# EAGLE design BBB_ADS1271_front_panel (EAGLE 7.5.0)
ADS1271 Input board This board creates 8 BNC inputs with TVS protection for use with 4 ADS1271EVM boards.
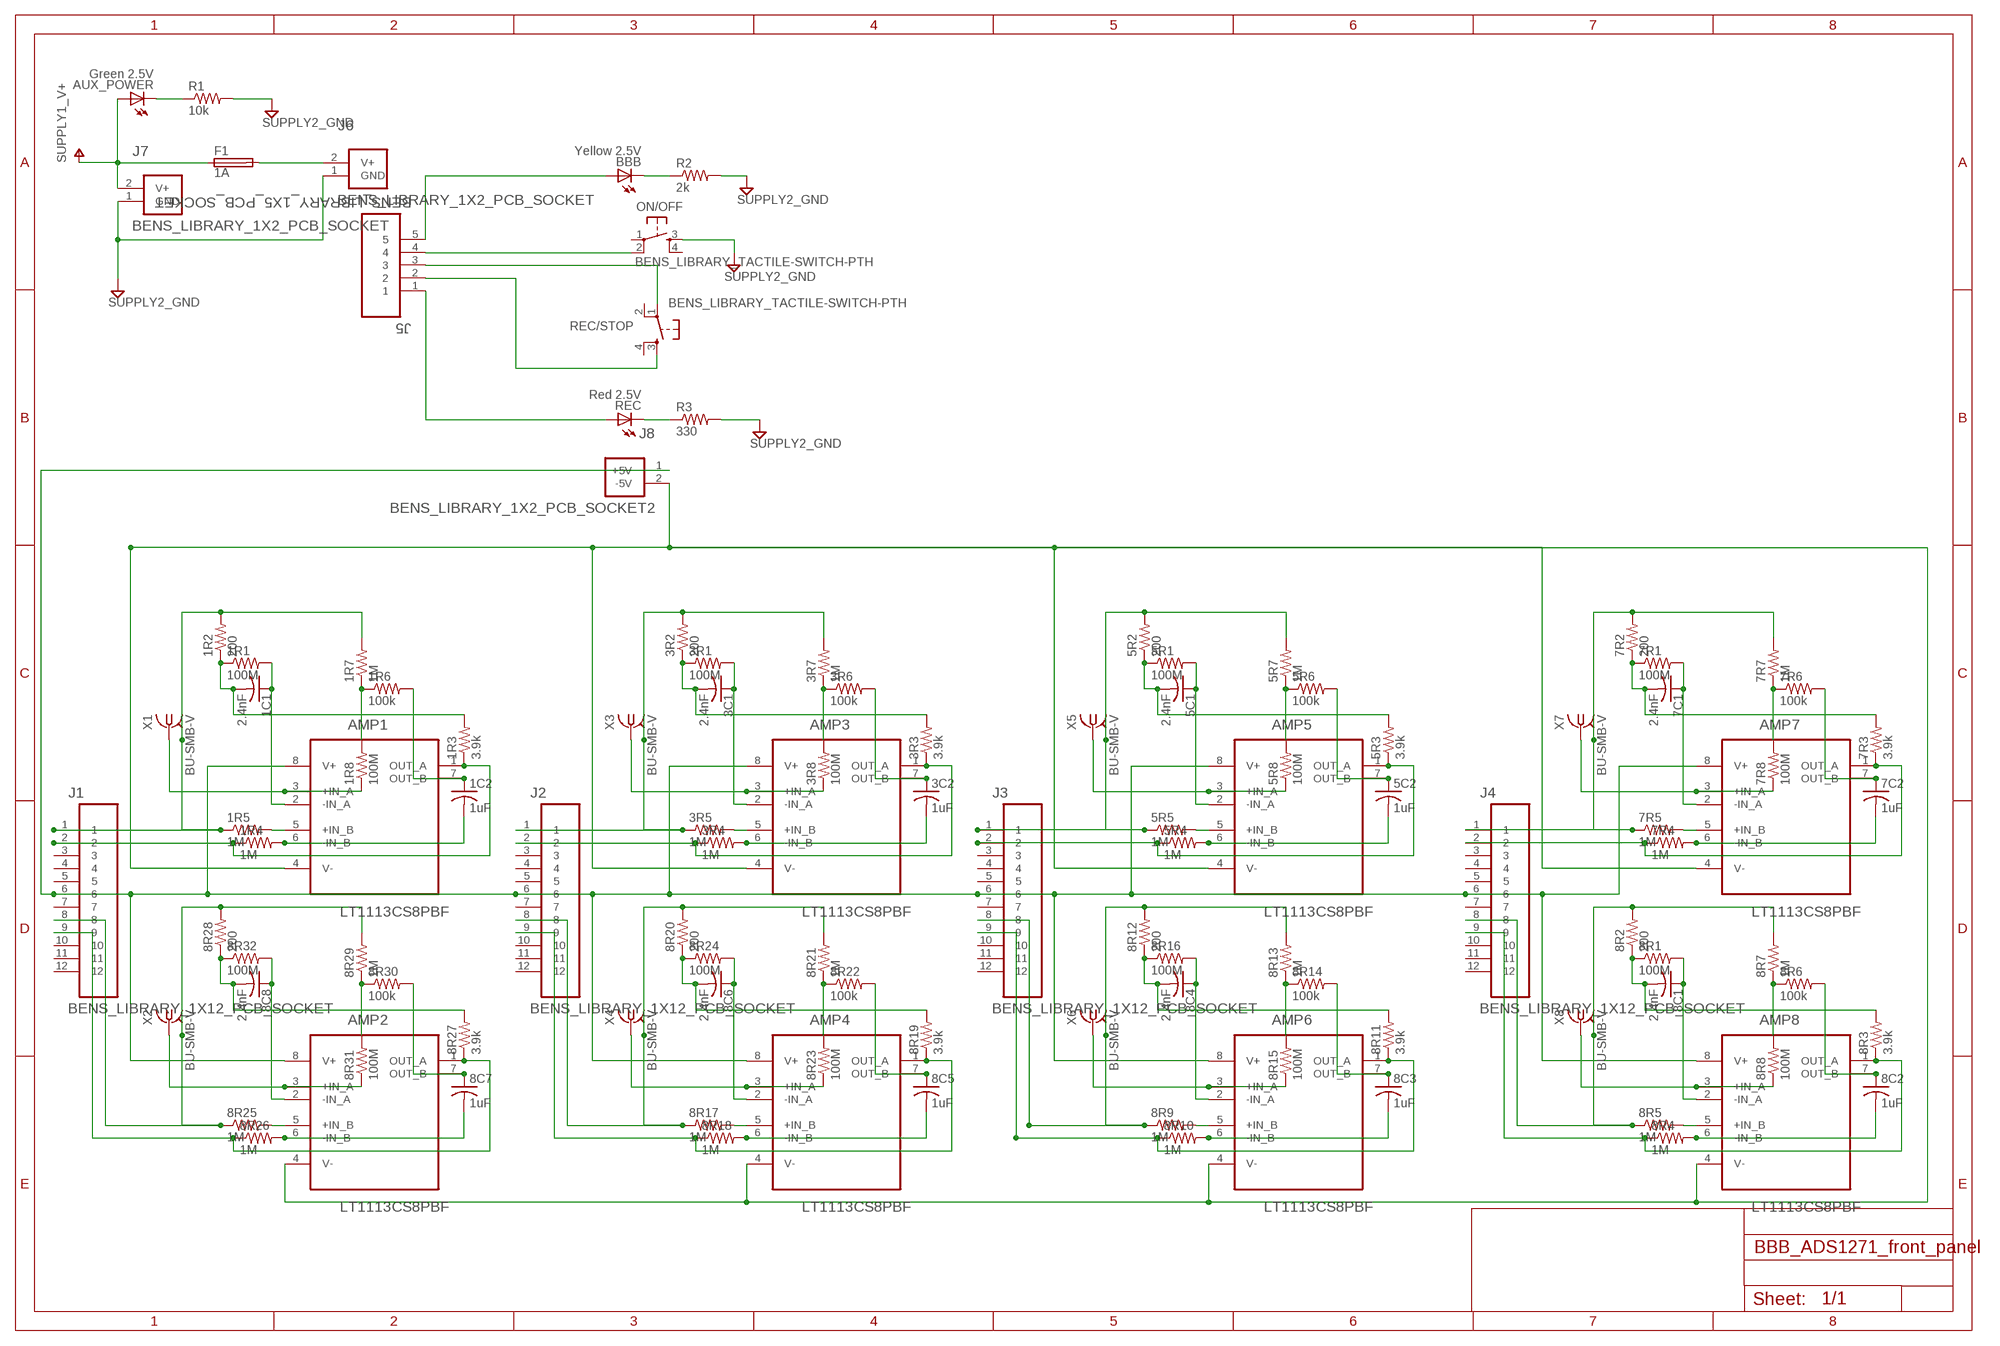
[diagram p0: schematic, sheet 1]

## Parts
1C1  2.4nF  ADAFRUIT_C-USC0805K  [ADAFRUIT_C0805K]
1C2  1uF  ADAFRUIT_C-USC0805K  [ADAFRUIT_C0805K]
1R1  100M  ADAFRUIT_R-US_R0805  [ADAFRUIT_R0805]
1R2  200  ADAFRUIT_R-US_R0805  [ADAFRUIT_R0805]
1R3  3.9k  ADAFRUIT_R-US_R0805  [ADAFRUIT_R0805]
1R4  1M  ADAFRUIT_R-US_R0805  [ADAFRUIT_R0805]
1R5  1M  ADAFRUIT_R-US_R0805  [ADAFRUIT_R0805]
1R6  100k  ADAFRUIT_R-US_R0805  [ADAFRUIT_R0805]
1R7  1M  ADAFRUIT_R-US_R0805  [ADAFRUIT_R0805]
1R8  100M  ADAFRUIT_R-US_R0805  [ADAFRUIT_R0805]
3C1  2.4nF  ADAFRUIT_C-USC0805K  [ADAFRUIT_C0805K]
3C2  1uF  ADAFRUIT_C-USC0805K  [ADAFRUIT_C0805K]
3R1  100M  ADAFRUIT_R-US_R0805  [ADAFRUIT_R0805]
3R2  200  ADAFRUIT_R-US_R0805  [ADAFRUIT_R0805]
3R3  3.9k  ADAFRUIT_R-US_R0805  [ADAFRUIT_R0805]
3R4  1M  ADAFRUIT_R-US_R0805  [ADAFRUIT_R0805]
3R5  1M  ADAFRUIT_R-US_R0805  [ADAFRUIT_R0805]
3R6  100k  ADAFRUIT_R-US_R0805  [ADAFRUIT_R0805]
3R7  1M  ADAFRUIT_R-US_R0805  [ADAFRUIT_R0805]
3R8  100M  ADAFRUIT_R-US_R0805  [ADAFRUIT_R0805]
5C1  2.4nF  ADAFRUIT_C-USC0805K  [ADAFRUIT_C0805K]
5C2  1uF  ADAFRUIT_C-USC0805K  [ADAFRUIT_C0805K]
5R1  100M  ADAFRUIT_R-US_R0805  [ADAFRUIT_R0805]
5R2  200  ADAFRUIT_R-US_R0805  [ADAFRUIT_R0805]
5R3  3.9k  ADAFRUIT_R-US_R0805  [ADAFRUIT_R0805]
5R4  1M  ADAFRUIT_R-US_R0805  [ADAFRUIT_R0805]
5R5  1M  ADAFRUIT_R-US_R0805  [ADAFRUIT_R0805]
5R6  100k  ADAFRUIT_R-US_R0805  [ADAFRUIT_R0805]
5R7  1M  ADAFRUIT_R-US_R0805  [ADAFRUIT_R0805]
5R8  100M  ADAFRUIT_R-US_R0805  [ADAFRUIT_R0805]
7C1  2.4nF  ADAFRUIT_C-USC0805K  [ADAFRUIT_C0805K]
7C2  1uF  ADAFRUIT_C-USC0805K  [ADAFRUIT_C0805K]
7R1  100M  ADAFRUIT_R-US_R0805  [ADAFRUIT_R0805]
7R2  200  ADAFRUIT_R-US_R0805  [ADAFRUIT_R0805]
7R3  3.9k  ADAFRUIT_R-US_R0805  [ADAFRUIT_R0805]
7R4  1M  ADAFRUIT_R-US_R0805  [ADAFRUIT_R0805]
7R5  1M  ADAFRUIT_R-US_R0805  [ADAFRUIT_R0805]
7R6  100k  ADAFRUIT_R-US_R0805  [ADAFRUIT_R0805]
7R7  1M  ADAFRUIT_R-US_R0805  [ADAFRUIT_R0805]
7R8  100M  ADAFRUIT_R-US_R0805  [ADAFRUIT_R0805]
8C1  2.4nF  ADAFRUIT_C-USC0805K  [ADAFRUIT_C0805K]
8C2  1uF  ADAFRUIT_C-USC0805K  [ADAFRUIT_C0805K]
8C3  1uF  ADAFRUIT_C-USC0805K  [ADAFRUIT_C0805K]
8C4  2.4nF  ADAFRUIT_C-USC0805K  [ADAFRUIT_C0805K]
8C5  1uF  ADAFRUIT_C-USC0805K  [ADAFRUIT_C0805K]
8C6  2.4nF  ADAFRUIT_C-USC0805K  [ADAFRUIT_C0805K]
8C7  1uF  ADAFRUIT_C-USC0805K  [ADAFRUIT_C0805K]
8C8  2.4nF  ADAFRUIT_C-USC0805K  [ADAFRUIT_C0805K]
8R1  100M  ADAFRUIT_R-US_R0805  [ADAFRUIT_R0805]
8R2  200  ADAFRUIT_R-US_R0805  [ADAFRUIT_R0805]
8R3  3.9k  ADAFRUIT_R-US_R0805  [ADAFRUIT_R0805]
8R4  1M  ADAFRUIT_R-US_R0805  [ADAFRUIT_R0805]
8R5  1M  ADAFRUIT_R-US_R0805  [ADAFRUIT_R0805]
8R6  100k  ADAFRUIT_R-US_R0805  [ADAFRUIT_R0805]
8R7  1M  ADAFRUIT_R-US_R0805  [ADAFRUIT_R0805]
8R8  100M  ADAFRUIT_R-US_R0805  [ADAFRUIT_R0805]
8R9  1M  ADAFRUIT_R-US_R0805  [ADAFRUIT_R0805]
8R10  1M  ADAFRUIT_R-US_R0805  [ADAFRUIT_R0805]
8R11  3.9k  ADAFRUIT_R-US_R0805  [ADAFRUIT_R0805]
8R12  200  ADAFRUIT_R-US_R0805  [ADAFRUIT_R0805]
8R13  1M  ADAFRUIT_R-US_R0805  [ADAFRUIT_R0805]
8R14  100k  ADAFRUIT_R-US_R0805  [ADAFRUIT_R0805]
8R15  100M  ADAFRUIT_R-US_R0805  [ADAFRUIT_R0805]
8R16  100M  ADAFRUIT_R-US_R0805  [ADAFRUIT_R0805]
8R17  1M  ADAFRUIT_R-US_R0805  [ADAFRUIT_R0805]
8R18  1M  ADAFRUIT_R-US_R0805  [ADAFRUIT_R0805]
8R19  3.9k  ADAFRUIT_R-US_R0805  [ADAFRUIT_R0805]
8R20  200  ADAFRUIT_R-US_R0805  [ADAFRUIT_R0805]
8R21  1M  ADAFRUIT_R-US_R0805  [ADAFRUIT_R0805]
8R22  100k  ADAFRUIT_R-US_R0805  [ADAFRUIT_R0805]
8R23  100M  ADAFRUIT_R-US_R0805  [ADAFRUIT_R0805]
8R24  100M  ADAFRUIT_R-US_R0805  [ADAFRUIT_R0805]
8R25  1M  ADAFRUIT_R-US_R0805  [ADAFRUIT_R0805]
8R26  1M  ADAFRUIT_R-US_R0805  [ADAFRUIT_R0805]
8R27  3.9k  ADAFRUIT_R-US_R0805  [ADAFRUIT_R0805]
8R28  200  ADAFRUIT_R-US_R0805  [ADAFRUIT_R0805]
8R29  1M  ADAFRUIT_R-US_R0805  [ADAFRUIT_R0805]
8R30  100k  ADAFRUIT_R-US_R0805  [ADAFRUIT_R0805]
8R31  100M  ADAFRUIT_R-US_R0805  [ADAFRUIT_R0805]
8R32  100M  ADAFRUIT_R-US_R0805  [ADAFRUIT_R0805]
AMP1  LT1113CS8PBF  [SOIC127P600X175-8N]
AMP2  LT1113CS8PBF  [SOIC127P600X175-8N]
AMP3  LT1113CS8PBF  [SOIC127P600X175-8N]
AMP4  LT1113CS8PBF  [SOIC127P600X175-8N]
AMP5  LT1113CS8PBF  [SOIC127P600X175-8N]
AMP6  LT1113CS8PBF  [SOIC127P600X175-8N]
AMP7  LT1113CS8PBF  [SOIC127P600X175-8N]
AMP8  LT1113CS8PBF  [SOIC127P600X175-8N]
AUX_POWER  Green 2.5V  ADAFRUIT_LED5MM  [ADAFRUIT_LED5MM]
BBB  Yellow 2.5V  ADAFRUIT_LED5MM  [ADAFRUIT_LED5MM]
F1  1A  LITTLEFUSE_SMD  [LITTLEFUSE_PACKAGE]
J1  BENS_LIBRARY_1X12_PCB_SOCKET  [BENS_LIBRARY_SAMTEC_SSM-112-L-DV-BE]
J2  BENS_LIBRARY_1X12_PCB_SOCKET  [BENS_LIBRARY_SAMTEC_SSM-112-L-DV-BE]
J3  BENS_LIBRARY_1X12_PCB_SOCKET  [BENS_LIBRARY_SAMTEC_SSM-112-L-DV-BE]
J4  BENS_LIBRARY_1X12_PCB_SOCKET  [BENS_LIBRARY_SAMTEC_SSM-112-L-DV-BE]
J5  BENS_LIBRARY_1X5_PCB_SOCKET  [BENS_LIBRARY_SAMTEC_SSM-15-L-DV-BE]
J6  BENS_LIBRARY_1X2_PCB_SOCKET  [BENS_LIBRARY_1X2_PCB_SOCKET]
J7  BENS_LIBRARY_1X2_PCB_SOCKET  [BENS_LIBRARY_1X2_PCB_SOCKET]
J8  BENS_LIBRARY_1X2_PCB_SOCKET2  [BENS_LIBRARY_1X2_PCB_SOCKET2]
ON/OFF  BENS_LIBRARY_TACTILE-SWITCH-PTH  [BENS_LIBRARY_TAC-SWITCH-PTH]
R1  10k  ADAFRUIT_R-US_R0805  [ADAFRUIT_R0805]
R2  2k  ADAFRUIT_R-US_R0805  [ADAFRUIT_R0805]
R3  330  ADAFRUIT_R-US_R0805  [ADAFRUIT_R0805]
REC  Red 2.5V  ADAFRUIT_LED5MM  [ADAFRUIT_LED5MM]
REC/STOP  BENS_LIBRARY_TACTILE-SWITCH-PTH  [BENS_LIBRARY_TAC-SWITCH-PTH]
X1  BU-SMB-V  [BU-SMB-V]
X2  BU-SMB-V  [BU-SMB-V]
X3  BU-SMB-V  [BU-SMB-V]
X4  BU-SMB-V  [BU-SMB-V]
X5  BU-SMB-V  [BU-SMB-V]
X6  BU-SMB-V  [BU-SMB-V]
X7  BU-SMB-V  [BU-SMB-V]
X8  BU-SMB-V  [BU-SMB-V]

## Nets
1+IN_B: 1R5.2 AMP1.5(+IN_B)
1-IN_A: 1C1.1 1R1.2 AMP1.2(-IN_A)
1-IN_B: 1C2.2 1R4.2 AMP1.6(-IN_B)
1OUT_B: 1C2.1 1R6.2 AMP1.7(OUT_B)
1W1: 1C1.2 1R1.1 1R2.1 1R3.2
1W2: 1R6.1 1R7.1 1R8.2
2+IN_B: 8R25.2 AMP2.5(+IN_B)
2-IN_A: 8C8.1 8R32.2 AMP2.2(-IN_A)
2-IN_B: 8C7.2 8R26.2 AMP2.6(-IN_B)
2OUT_B: 8C7.1 8R30.2 AMP2.7(OUT_B)
2W1: 8C8.2 8R27.2 8R28.1 8R32.1
2W2: 8R29.1 8R30.1 8R31.2
3+IN_B: 3R5.2 AMP3.5(+IN_B)
3-IN_A: 3C1.1 3R1.2 AMP3.2(-IN_A)
3-IN_B: 3C2.2 3R4.2 AMP3.6(-IN_B)
3OUT_B: 3C2.1 3R6.2 AMP3.7(OUT_B)
3W1: 3C1.2 3R1.1 3R2.1 3R3.2
3W2: 3R6.1 3R7.1 3R8.2
4+IN_B: 8R17.2 AMP4.5(+IN_B)
4-IN_A: 8C6.1 8R24.2 AMP4.2(-IN_A)
4-IN_B: 8C5.2 8R18.2 AMP4.6(-IN_B)
4OUT_B: 8C5.1 8R22.2 AMP4.7(OUT_B)
4W1: 8C6.2 8R19.2 8R20.1 8R24.1
4W2: 8R21.1 8R22.1 8R23.2
5+IN_B: 5R5.2 AMP5.5(+IN_B)
5-IN_A: 5C1.1 5R1.2 AMP5.2(-IN_A)
5-IN_B: 5C2.2 5R4.2 AMP5.6(-IN_B)
5OUT_B: 5C2.1 5R6.2 AMP5.7(OUT_B)
5W1: 5C1.2 5R1.1 5R2.1 5R3.2
5W2: 5R6.1 5R7.1 5R8.2
6+IN_B: 8R9.2 AMP6.5(+IN_B)
6-IN_A: 8C4.1 8R16.2 AMP6.2(-IN_A)
6-IN_B: 8C3.2 8R10.2 AMP6.6(-IN_B)
6OUT_B: 8C3.1 8R14.2 AMP6.7(OUT_B)
6W1: 8C4.2 8R11.2 8R12.1 8R16.1
6W2: 8R13.1 8R14.1 8R15.2
7+IN_B: 7R5.2 AMP7.5(+IN_B)
7-IN_A: 7C1.1 7R1.2 AMP7.2(-IN_A)
7-IN_B: 7C2.2 7R4.2 AMP7.6(-IN_B)
7OUT_B: 7C2.1 7R6.2 AMP7.7(OUT_B)
7W1: 7C1.2 7R1.1 7R2.1 7R3.2
7W2: 7R6.1 7R7.1 7R8.2
8+IN_B: 8R5.2 AMP8.5(+IN_B)
8-IN_A: 8C1.1 8R1.2 AMP8.2(-IN_A)
8-IN_B: 8C2.2 8R4.2 AMP8.6(-IN_B)
8OUT_B: 8C2.1 8R6.2 AMP8.7(OUT_B)
8W1: 8C1.2 8R1.1 8R2.1 8R3.2
8W2: 8R6.1 8R7.1 8R8.2
+5V: AMP1.8(V+) AMP2.8(V+) AMP3.8(V+) AMP4.8(V+) AMP5.8(V+) AMP6.8(V+) AMP7.8(V+) AMP8.8(V+) J1.6 J2.6 J3.6 J4.6 J8.1(+5V)
-5V: AMP1.4(V-) AMP2.4(V-) AMP3.4(V-) AMP4.4(V-) AMP5.4(V-) AMP6.4(V-) AMP7.4(V-) AMP8.4(V-) J8.2(-5V)
ADC1_NEG: 1R3.1 1R4.1 AMP1.1(OUT_A) J1.2
ADC1_POS: 1R2.2 1R5.1 1R7.2 J1.1 X1.2 X1.3 X1.4 X1.5
ADC2_NEG: 8R26.1 8R27.1 AMP2.1(OUT_A) J1.9
ADC2_POS: 8R25.1 8R28.2 8R29.2 J1.8 X2.2 X2.3 X2.4 X2.5
ADC3_NEG: 3R3.1 3R4.1 AMP3.1(OUT_A) J2.2
ADC3_POS: 3R2.2 3R5.1 3R7.2 J2.1 X3.2 X3.3 X3.4 X3.5
ADC4_NEG: 8R18.1 8R19.1 AMP4.1(OUT_A) J2.9
ADC4_POS: 8R17.1 8R20.2 8R21.2 J2.8 X4.2 X4.3 X4.4 X4.5
ADC5_NEG: 5R3.1 5R4.1 AMP5.1(OUT_A) J3.2
ADC5_POS: 5R2.2 5R5.1 5R7.2 J3.1 X5.2 X5.3 X5.4 X5.5
ADC6_NEG: 8R10.1 8R11.1 AMP6.1(OUT_A) J3.9
ADC6_POS: 8R9.1 8R12.2 8R13.2 J3.8 X6.2 X6.3 X6.4 X6.5
ADC7_NEG: 7R3.1 7R4.1 AMP7.1(OUT_A) J4.2
ADC7_POS: 7R2.2 7R5.1 7R7.2 J4.1 X7.2 X7.3 X7.4 X7.5
ADC8_NEG: 8R3.1 8R4.1 AMP8.1(OUT_A) J4.9
ADC8_POS: 8R2.2 8R5.1 8R7.2 J4.8 X8.2 X8.3 X8.4 X8.5
GND: J6.1(GND) J7.1(GND) ON/OFF.3 R1.2 R2.2 R3.2 ; supply symbol labelled SUPPLY2_GND
INPUT1_NEG: 1R8.1 AMP1.3(+IN_A) X1.1
INPUT2_NEG: 8R31.1 AMP2.3(+IN_A) X2.1
INPUT3_NEG: 3R8.1 AMP3.3(+IN_A) X3.1
INPUT4_NEG: 8R23.1 AMP4.3(+IN_A) X4.1
INPUT5_NEG: 5R8.1 AMP5.3(+IN_A) X5.1
INPUT6_NEG: 8R15.1 AMP6.3(+IN_A) X6.1
INPUT7_NEG: 7R8.1 AMP7.3(+IN_A) X7.1
INPUT8_NEG: 8R8.1 AMP8.3(+IN_A) X8.1
N$10: BBB.A J5.5
N$11: AUX_POWER.K(C) R1.1
N$12: J5.1 REC.A
N$13: J5.4 ON/OFF.2
N$15: J5.3 REC/STOP.1
N$16: J5.2 REC/STOP.3
N$18: R3.1 REC.K(C)
N$20: BBB.K(C) R2.1
V+: AUX_POWER.A F1.P$1 J7.2(V+) ; supply symbol labelled SUPPLY1_V+
V+_FUSED: F1.P$2 J6.2(V+)
Unconnected: J1.3 J1.4 J1.5 J1.7 J1.10 J1.11 J1.12 J2.3 J2.4 J2.5 J2.7 J2.10 J2.11 J2.12 J3.3 J3.4 J3.5 J3.7 J3.10 J3.11 J3.12 J4.3 J4.4 J4.5 J4.7 J4.10 J4.11 J4.12 ON/OFF.1 ON/OFF.4 REC/STOP.2 REC/STOP.4

## Library data of the parts
1C1 1C2 3C1 3C2 5C1 5C2 7C1 7C2 8C1-8C8 = BBB_ADS1271_front_panel:ADAFRUIT_C-US: CAPACITOR, American symbol
1R1-1R8 3R1-3R8 5R1-5R8 7R1-7R8 8R1-8R32 R1-R3 = BBB_ADS1271_front_panel:ADAFRUIT_R-US_: RESISTOR, American symbol
AMP1-AMP8 = BBB_ADS1271_front_panel:LT1113CS8PBF: Dual Low Noise,Precision, JFET Input Op Amp; MPN: LT1113CS8#PBF; OC_FARNELL: 1503417; OC_NEWARK: 57M1747; PACKAGE: SOIC-8; SUPPLIER: Linear Technology
AUX_POWER BBB REC = BBB_ADS1271_front_panel:ADAFRUIT_LED: LED OSRAM: - CHIPLED LG R971, LG N971, LY N971, LG Q971, LY Q971, LO R971, LY R971 LH N974, LH R974 LS Q976, LO Q976, LY Q976 LO Q996 - Hyper CHIPLED LW Q18S LB Q993, LB Q99A, LB R99A - SideLED LS A670, LO A670, LY A670, LG A670, LP A670 LB A673, LV A673, LT A673, LW A673 LH A674 LY A675 LS A676, LA A676, LO A676, LY A676, LW A676 LS A679, LY A679, LG A679 - Hyper Micro SIDELED® LS Y876, LA Y876, LO Y876, LY Y876 LT Y87S - SmartLED LW L88C, LW L88S LB L89C, LB L89S, LG L890 LS L89K, LO L89K, LY L89K LS L896, LA L896, LO L896, LY L896 - TOPLED LS T670, LO T670, LY T670, LG T670, LP T670 LSG T670, LSP T670, LSY T670, LOP T670, LYG T670 LG T671, LOG T671, LSG T671 LB T673, LV T673, LT T673, LW T673 LH T674 LS T676, LA T676, LO T676, LY T676, LB T676, LH T676, LSB T676, LW T676 LB T67C, LV T67C, LT T67C, LS T67K, LO T67K, LY T67K, LW E67C LS E67B, LA E67B, LO E67B, LY E67B, LB E67C, LV E67C, LT E67C LW T67C LS T679, LY T679, LG T679 LS T770, LO T770, LY T770, LG T770, LP T770 LB T773, LV T773, LT T773, LW T773 LH T774 LS E675, LA E675, LY E675, LS T675 LS T776, LA T776, LO T776, LY T776, LB T776 LHGB T686 LT T68C, LB T68C - Hyper Mini TOPLED® LB M676 - Mini TOPLED Santana® LG M470 LS M47K, LO M47K, LY M47K Source: http://www.osram.convergy.de/
F1 = BBB_ADS1271_front_panel:LITTLEFUSE_SMD: FUSE HOLDER LittleFuse surface mounted fuse
J1-J4 = BBB_ADS1271_front_panel:BENS_LIBRARY_1X12_PCB_SOCKET: CONN SOCKET, 2.54MM, SMT, 1X12WAY; MPN: SSM-112-L-DV-BE; OC_FARNELL: -; OC_NEWARK: 81P5226; PACKAGE: SOCKET, 2.54MM, SMT, 2X12WAY; SUPPLIER: SAMTEC
J5 = BBB_ADS1271_front_panel:BENS_LIBRARY_1X5_PCB_SOCKET: CONN SOCKET, 2.54MM, SMT, 1X5WAY
J6 J7 = BBB_ADS1271_front_panel:BENS_LIBRARY_1X2_PCB_SOCKET: CONN SOCKET, 2.54MM, SMT, 1X5WAY
J8 = BBB_ADS1271_front_panel:BENS_LIBRARY_1X2_PCB_SOCKET2: CONN SOCKET, 2.54MM, SMT, 1X5WAY
ON/OFF REC/STOP = BBB_ADS1271_front_panel:BENS_LIBRARY_TACTILE-SWITCH: Tactile Switch 4 Pins, SPST NO
X1-X8 = BBB_ADS1271_front_panel:BU-SMB-V: FEMALE SMB CONNECTOR Radiall distributor RS 112-2993; OC_FARNELL: unknown; OC_NEWARK: unknown

## Board
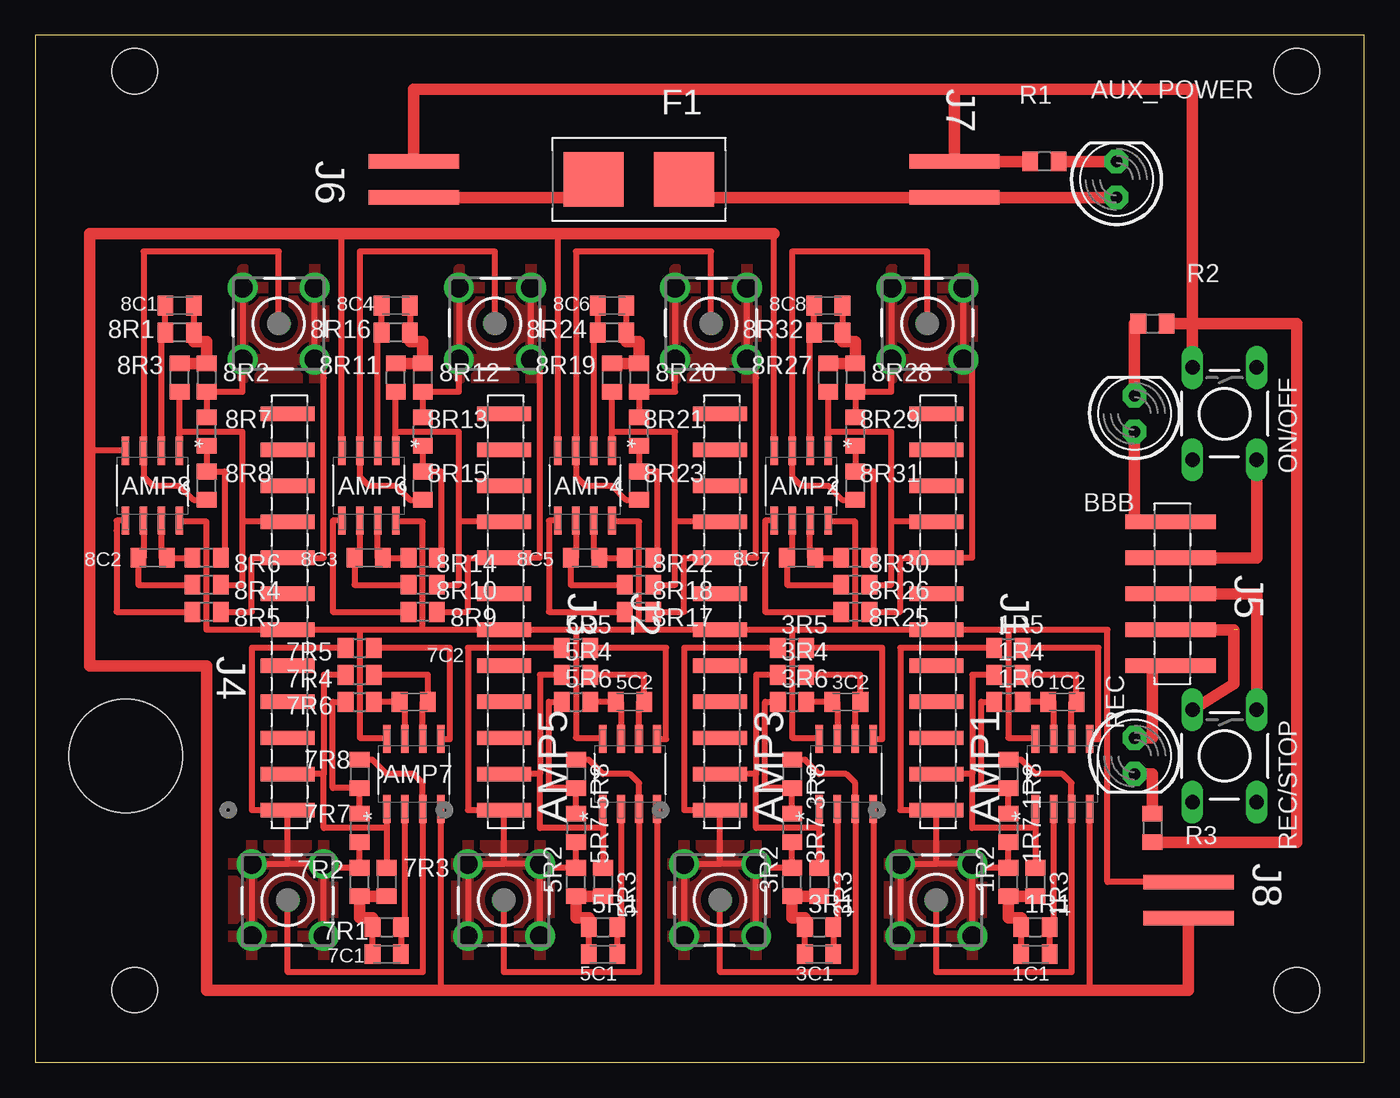
[diagram p1: board, top side]

Size 93.65 x 72.38 mm. Coordinates in mm from the lower left corner, seen from the top.
Outline: 0,0 93.65,0 93.65,72.38 0,72.38 0,0
Copper layers (1*16): Top 0.035mm / dielectric 1.5mm / Bottom 0.035mm
Design rules "default *": minimum track width 10mil, minimum drill 24mil, track to track 20mil, track to pad 20mil, pad to pad 20mil, via to via 20mil, smd to smd 8mil, copper to edge 40mil, drill to drill 8mil, minimum pad ring 10mil, minimum via ring 8mil, stop-mask expansion 4mil, vias tented up to drill 0mil, thermal gap 10mil
Holes 3.2 mm at 6.99,69.85 88.9,69.85 88.9,5.08 6.99,5.08
Holes 8 mm at 6.35,21.59
tKeepout: area 0,0 to 94,72.4

### Footprints (pad centres in the part's own frame; a part is rotated, then mirrored left to right if it is on the bottom)
ADAFRUIT_C0805K = smd 1.1 x 1.4: 1 -1,0; 2 1,0
ADAFRUIT_R0805 = smd 1.1 x 1.4: 1 -1,0; 2 1,0
SOIC127P600X175-8N = smd 1.981 x 0.533: 1 -2.464,1.905; 2 -2.464,0.635; 3 -2.464,-0.635; 4 -2.464,-1.905; 5 2.464,-1.905; 6 2.464,-0.635; 7 2.464,0.635; 8 2.464,1.905
ADAFRUIT_LED5MM = drill 0.813 pad 1.676 octagon: A -1.27,0; K 1.27,0
LITTLEFUSE_PACKAGE = smd 4.242 x 3.81: P$1 0,0; P$2 6.375,0
BENS_LIBRARY_SAMTEC_SSM-112-L-DV-BE = smd 1.016 x 3.81: 1 27.94,0; 2 25.4,0; 3 22.86,0; 4 20.32,0; 5 17.78,0; 6 15.24,0; 7 12.7,0; 8 10.16,0; 9 7.62,0; 10 5.08,0; 11 2.54,0; 12 0,0
BENS_LIBRARY_SAMTEC_SSM-15-L-DV-BE = smd 1.016 x 6.35: 1 12.7,0; 2 10.16,0; 3 7.62,0; 4 5.08,0; 5 2.54,0
BENS_LIBRARY_1X2_PCB_SOCKET = smd 1.016 x 6.35: 1 2.54,0; 2 5.08,0
BENS_LIBRARY_1X2_PCB_SOCKET2 = smd 1.016 x 6.35: 1 2.54,0; 2 5.08,0
BENS_LIBRARY_TAC-SWITCH-PTH = drill 1.016 pad 1.524 long: 1 -3.251,2.261; 2 3.251,2.261; 3 -3.251,-2.261; 4 3.251,-2.261
BU-SMB-V = drill 1.1: 1 0,0 | drill 1.4: 2 -2.54,2.54; 3 2.54,2.54; 4 2.54,-2.54; 5 -2.54,-2.54

### Placement (x,y rotation side)
1C1  70.48,7.62 180 top
1C2  72.39,25.4 0 top
1R1  70.48,9.53 0 top
1R2  68.58,12.7 90 top
1R3  70.48,12.7 270 top
1R4  68.58,27.3 0 top
1R5  68.58,29.21 0 top
1R6  68.58,25.4 0 top
1R7  68.58,16.51 270 top
1R8  68.58,20.32 270 top
3C1  55.24,7.62 180 top
3C2  57.15,25.4 0 top
3R1  55.24,9.53 0 top
3R2  53.34,12.7 90 top
3R3  55.24,12.7 270 top
3R4  53.34,27.3 0 top
3R5  53.34,29.21 0 top
3R6  53.34,25.4 0 top
3R7  53.34,16.51 270 top
3R8  53.34,20.32 270 top
5C1  40.01,7.62 180 top
5C2  41.91,25.4 0 top
5R1  40.01,9.53 0 top
5R2  38.1,12.7 90 top
5R3  40.01,12.7 270 top
5R4  38.1,27.3 0 top
5R5  38.1,29.21 0 top
5R6  38.1,25.4 0 top
5R7  38.1,16.51 270 top
5R8  38.1,20.32 270 top
7C1  24.77,7.62 180 top
7C2  26.67,25.4 0 top
7R1  24.77,9.53 0 top
7R2  22.86,12.7 90 top
7R3  24.77,12.7 270 top
7R4  22.86,27.3 0 top
7R5  22.86,29.21 0 top
7R6  22.86,25.4 0 top
7R7  22.86,16.51 270 top
7R8  22.86,20.32 270 top
8C1  10.16,53.34 0 top
8C2  8.26,35.56 180 top
8C3  23.5,35.56 180 top
8C4  25.4,53.34 0 top
8C5  38.73,35.56 180 top
8C6  40.64,53.34 0 top
8C7  53.98,35.56 180 top
8C8  55.88,53.34 0 top
8R1  10.16,51.44 180 top
8R2  12.06,48.26 270 top
8R3  10.16,48.26 90 top
8R4  12.06,33.66 180 top
8R5  12.06,31.75 180 top
8R6  12.06,35.56 180 top
8R7  12.06,44.45 90 top
8R8  12.06,40.64 90 top
8R9  27.3,31.75 180 top
8R10  27.3,33.66 180 top
8R11  25.4,48.26 90 top
8R12  27.3,48.26 270 top
8R13  27.3,44.45 90 top
8R14  27.3,35.56 180 top
8R15  27.3,40.64 90 top
8R16  25.4,51.44 180 top
8R17  42.55,31.75 180 top
8R18  42.55,33.66 180 top
8R19  40.64,48.26 90 top
8R20  42.55,48.26 270 top
8R21  42.55,44.45 90 top
8R22  42.55,35.56 180 top
8R23  42.55,40.64 90 top
8R24  40.64,51.44 180 top
8R25  57.78,31.75 180 top
8R26  57.78,33.66 180 top
8R27  55.88,48.26 90 top
8R28  57.78,48.26 270 top
8R29  57.78,44.45 90 top
8R30  57.78,35.56 180 top
8R31  57.78,40.64 90 top
8R32  55.88,51.44 180 top
AMP1  72.39,20.32 90 top
AMP2  53.98,40.64 270 top
AMP3  57.15,20.32 90 top
AMP4  38.73,40.64 270 top
AMP5  41.91,20.32 90 top
AMP6  23.5,40.64 270 top
AMP7  26.67,20.32 90 top
AMP8  8.26,40.64 270 top
AUX_POWER  76.2,62.23 90 top
BBB  77.47,45.72 90 top
F1  45.72,62.23 180 top
J1  63.5,45.72 270 top
J2  48.26,45.72 270 top
J3  33.02,45.72 270 top
J4  17.78,45.72 270 top
J5  80.01,40.64 270 top
J6  26.67,66.04 270 top
J7  64.77,66.04 270 top
J8  81.28,15.24 270 top
ON/OFF  83.82,45.72 270 top
R1  71.12,63.5 180 top
R2  78.74,52.07 0 top
R3  78.74,16.51 270 top
REC  77.47,21.59 270 top
REC/STOP  83.82,21.59 270 top
X1  63.5,11.43 180 top
X2  62.87,52.07 0 top
X3  48.26,11.43 180 top
X4  47.62,52.07 0 top
X5  33.02,11.43 180 top
X6  32.38,52.07 0 top
X7  17.78,11.43 180 top
X8  17.14,52.07 0 top

### Tracks (layer width: path | path; a pad name or v marks a point on that pad's centre or on a via)
1+IN_B
  Top 0.406: AMP1.5 74.93,22.78 74.93,29.21 1R5.2
1-IN_A
  Top 0.406: 1C1.1 1R1.2 71.75,10.16 AMP1.2
1-IN_B
  Top 0.406: AMP1.6 73.03,25.4 1C2.2 73.39,27.3 1R4.2
1OUT_B
  Top 0.406: 1R6.2 1C2.1 71.75,25.4 AMP1.7
1W1
  Top 0.406: 1C1.2 1R1.1
  Top 0.813: 1R1.1 69.48,10.16 68.58,10.16 1R2.1 1R3.2
1W2
  Top 0.406: 1R7.1 1R8.2 66.67,19.32 66.67,25.4 1R6.1
2+IN_B
  Top 0.406: AMP2.5 51.44,38.18 51.44,31.75 8R25.2
2-IN_A
  Top 0.406: 8C8.1 8R32.2 54.61,50.8 AMP2.2
2-IN_B
  Top 0.406: AMP2.6 53.34,35.56 8C7.2 52.98,33.66 8R26.2
2OUT_B
  Top 0.406: 8R30.2 8C7.1 54.61,35.56 AMP2.7
2W1
  Top 0.406: 8C8.2 8R32.1
  Top 0.813: 8R32.1 56.88,50.8 57.78,50.8 8R28.1 8R27.2
2W2
  Top 0.406: 8R29.1 8R31.2 59.05,41.64 59.05,35.56 8R30.1
3+IN_B
  Top 0.406: AMP3.5 59.69,22.78 59.69,29.21 3R5.2
3-IN_A
  Top 0.406: 3C1.1 3R1.2 56.52,10.16 AMP3.2
3-IN_B
  Top 0.406: AMP3.6 57.78,25.4 3C2.2 58.15,27.3 3R4.2
3OUT_B
  Top 0.406: 3R6.2 3C2.1 56.52,25.4 AMP3.7
3W1
  Top 0.406: 3C1.2 3R1.1
  Top 0.813: 3R1.1 54.24,10.16 53.34,10.16 3R2.1 3R3.2
3W2
  Top 0.406: 3R7.1 3R8.2 51.44,19.32 51.44,25.4 3R6.1
4+IN_B
  Top 0.406: AMP4.5 36.2,38.18 36.2,31.75 8R17.2
4-IN_A
  Top 0.406: 8C6.1 8R24.2 39.37,50.8 AMP4.2
4-IN_B
  Top 0.406: AMP4.6 38.1,35.56 8C5.2 37.73,33.66 8R18.2
4OUT_B
  Top 0.406: 8R22.2 8C5.1 39.37,35.56 AMP4.7
4W1
  Top 0.406: 8C6.2 8R24.1
  Top 0.813: 8R24.1 41.64,50.8 42.55,50.8 8R20.1 8R19.2
4W2
  Top 0.406: 8R21.1 8R23.2 43.81,41.64 43.81,35.56 8R22.1
5+IN_B
  Top 0.406: AMP5.5 44.45,22.78 44.45,29.21 5R5.2
5-IN_A
  Top 0.406: 5C1.1 5R1.2 41.27,10.16 AMP5.2
5-IN_B
  Top 0.406: AMP5.6 42.55,25.4 5C2.2 42.91,27.3 5R4.2
5OUT_B
  Top 0.406: 5R6.2 5C2.1 41.27,25.4 AMP5.7
5W1
  Top 0.406: 5C1.2 5R1.1
  Top 0.813: 5R1.1 39.01,10.16 38.1,10.16 5R2.1 5R3.2
5W2
  Top 0.406: 5R7.1 5R8.2 36.2,19.32 36.2,25.4 5R6.1
6+IN_B
  Top 0.406: AMP6.5 20.95,38.18 20.95,31.75 8R9.2
6-IN_A
  Top 0.406: 8C4.1 8R16.2 24.13,50.8 AMP6.2
6-IN_B
  Top 0.406: AMP6.6 22.86,35.56 8C3.2 22.5,33.66 8R10.2
6OUT_B
  Top 0.406: 8R14.2 8C3.1 24.13,35.56 AMP6.7
6W1
  Top 0.406: 8C4.2 8R16.1
  Top 0.813: 8R16.1 26.4,50.8 27.3,50.8 8R12.1 8R11.2
6W2
  Top 0.406: 8R13.1 8R15.2 28.57,41.64 28.57,35.56 8R14.1
7+IN_B
  Top 0.406: AMP7.5 29.21,22.78 29.21,29.21 7R5.2
7-IN_A
  Top 0.406: 7C1.1 7R1.2 26.04,10.16 AMP7.2
7-IN_B
  Top 0.406: AMP7.6 27.3,25.4 7C2.2 27.67,27.3 7R4.2
7OUT_B
  Top 0.406: 7R6.2 7C2.1 26.04,25.4 AMP7.7
7W1
  Top 0.406: 7C1.2 7R1.1
  Top 0.813: 7R1.1 23.77,10.16 22.86,10.16 7R2.1 7R3.2
7W2
  Top 0.406: 7R7.1 7R8.2 20.95,19.32 20.95,25.4 7R6.1
8+IN_B
  Top 0.406: AMP8.5 5.71,38.18 5.71,37.47 5.71,31.75 8R5.2
8-IN_A
  Top 0.406: 8C1.1 8R1.2 8.89,50.8 AMP8.2
8-IN_B
  Top 0.406: AMP8.6 7.62,35.56 8C2.2 7.25,33.66 8R4.2
8OUT_B
  Top 0.406: 8R6.2 8C2.1 8.89,35.56 AMP8.7
8W1
  Top 0.406: 8C1.2 8R1.1
  Top 0.813: 8R1.1 11.16,50.8 12.06,50.8 8R2.1 8R3.2
8W2
  Top 0.406: 8R7.1 8R8.2 13.34,41.64 13.34,35.56 8R6.1
+5V
  Top 0.406: 22.86,30.48 22.86,22.86 24.77,22.86 AMP7.8 | J8.1 75.56,12.7 75.56,30.48 68.58,30.48 | J1.6 53.34,30.48 | J2.6 38.1,30.48 | J3.6 22.86,30.48 | 22.86,30.48 J4.6 12.06,30.48 12.06,38.1 10.16,38.1 AMP8.8 | 38.1,30.48 38.1,22.86 40.01,22.86 AMP5.8 | 38.1,30.48 J3.6 | 53.34,30.48 53.34,22.86 55.24,22.86 AMP3.8 | 53.34,30.48 J2.6 | 68.58,30.48 68.58,22.86 70.48,22.86 AMP1.8 | 68.58,30.48 J1.6 | AMP6.8 25.4,38.1 27.3,38.1 27.3,30.48 J3.6 | AMP4.8 40.64,38.1 42.55,38.1 42.55,30.48 J2.6 | AMP2.8 55.88,38.1 57.78,38.1 57.78,30.48 J1.6
-5V
  Top 0.406: 28.57,5.08 AMP7.4 | AMP5.4 43.81,5.08 | AMP3.4 59.05,5.08 | AMP1.4 74.3,5.08 | AMP8.4 3.81,43.1 | AMP6.4 21.59,58.42 | AMP4.4 36.83,58.42 | AMP2.4 52.07,58.42
  Top 0.813: J8.2 81.28,5.08 74.3,5.08 59.05,5.08 43.81,5.08 28.57,5.08 12.06,5.08 12.06,27.94 3.81,27.94 3.81,43.1 3.81,58.42 21.59,58.42 36.83,58.42 52.07,58.42
ADC1_NEG
  Top 0.406: 1R3.1 AMP1.1 70.48,16.51 66.04,16.51 66.04,20.32 | 1R4.1 66.04,27.3 66.04,20.32 | 66.04,20.32 J1.2
ADC1_POS
  Top 0.406: 1R5.1 60.96,29.21 60.96,17.78 J1.1 63.5,13.97 | 1R7.2 1R2.2 66.04,13.7 X1.5 | X1.2 X1.5 | X1.5 63.5,13.97 | 63.5,13.97 X1.4 X1.3
  pour Top: 59.69,7.62 66.67,7.62 66.67,15.24 59.69,15.24
ADC2_NEG
  Top 0.406: 55.88,44.45 8R27.1 | 8R26.1 60.33,33.66 60.33,38.1 | 60.33,38.1 60.33,44.45 55.88,44.45 | AMP2.1 55.88,44.45 | J1.9 60.33,38.1
ADC2_POS
  Top 0.406: 8R29.2 8R28.2 60.33,47.26 X2.5 | 60.96,49.8 X2.5 | X2.2 X2.5 | X2.3 X2.4 66.04,49.53 66.04,48.26 66.04,35.56 J1.8 60.96,35.56 60.96,31.75 8R25.1
  pour Top: 66.04,55.88 60.33,55.88 60.33,48.26 66.04,48.26
ADC3_NEG
  Top 0.406: 3R3.1 AMP3.1 55.24,16.51 50.8,16.51 50.8,20.32 | 3R4.1 50.8,27.3 50.8,20.32 | 50.8,20.32 J2.2
ADC3_POS
  Top 0.406: 3R5.1 45.72,29.21 45.72,17.78 J2.1 48.26,13.97 | 3R7.2 3R2.2 50.8,13.7 X3.5 | X3.2 X3.5 | X3.5 48.26,13.97 | 48.26,13.97 X3.4 X3.3
  pour Top: 44.45,7.62 51.44,7.62 51.44,15.24 44.45,15.24
ADC4_NEG
  Top 0.406: 40.64,44.45 8R19.1 | 8R18.1 45.09,33.66 45.09,38.1 | 45.09,38.1 45.09,44.45 40.64,44.45 | AMP4.1 40.64,44.45 | J2.9 45.09,38.1
ADC4_POS
  Top 0.406: 8R21.2 8R20.2 45.09,47.26 X4.5 | 45.72,49.8 X4.5 | X4.2 X4.5 | X4.3 X4.4 50.8,49.53 50.8,48.26 50.8,35.56 J2.8 45.72,35.56 45.72,31.75 8R17.1
  pour Top: 50.8,55.88 45.09,55.88 45.09,48.26 50.8,48.26
ADC5_NEG
  Top 0.406: 5R3.1 AMP5.1 40.01,16.51 35.56,16.51 35.56,20.32 | 5R4.1 35.56,27.3 35.56,20.32 | 35.56,20.32 J3.2
ADC5_POS
  Top 0.406: 5R5.1 30.48,29.21 30.48,17.78 J3.1 33.02,13.97 | 5R7.2 5R2.2 35.56,13.7 X5.5 | X5.2 X5.5 | X5.5 33.02,13.97 | 33.02,13.97 X5.4 X5.3
  pour Top: 29.21,7.62 36.2,7.62 36.2,15.24 29.21,15.24
ADC6_NEG
  Top 0.406: 25.4,44.45 8R11.1 | 8R10.1 29.84,33.66 29.84,38.1 | 29.84,38.1 29.84,44.45 25.4,44.45 | AMP6.1 25.4,44.45 | J3.9 29.84,38.1
ADC6_POS
  Top 0.406: 8R13.2 8R12.2 29.84,47.26 X6.5 | 30.48,49.8 X6.5 | X6.2 X6.5 | X6.3 X6.4 35.56,49.53 35.56,48.26 35.56,35.56 J3.8 30.48,35.56 30.48,31.75 8R9.1
  pour Top: 35.56,55.88 29.84,55.88 29.84,48.26 35.56,48.26
ADC7_NEG
  Top 0.406: 7R3.1 AMP7.1 24.77,16.51 20.32,16.51 20.32,20.32 | 7R4.1 20.32,27.3 20.32,20.32 | 20.32,20.32 J4.2
ADC7_POS
  Top 0.406: 7R5.1 15.24,29.21 15.24,17.78 J4.1 17.78,13.97 | 7R7.2 7R2.2 20.32,13.7 X7.5 | X7.2 X7.5 | X7.5 17.78,13.97 | 17.78,13.97 X7.4 X7.3
  pour Top: 13.97,7.62 20.95,7.62 20.95,15.24 13.97,15.24
ADC8_NEG
  Top 0.406: 10.16,44.45 8R3.1 | 8R4.1 14.61,33.66 14.61,38.1 | 14.61,38.1 14.61,44.45 10.16,44.45 | AMP8.1 10.16,44.45 | J4.9 14.61,38.1
ADC8_POS
  Top 0.406: 8R7.2 8R2.2 14.61,47.26 X8.5 | 15.24,49.8 X8.5 | X8.2 X8.5 | X8.3 X8.4 20.32,49.53 20.32,48.26 20.32,35.56 J4.8 15.24,35.56 15.24,31.75 8R5.1
  pour Top: 20.32,55.88 14.61,55.88 14.61,48.26 20.32,48.26
GND
  Top 0.813: J6.1 26.67,68.58 64.77,68.58 | R1.2 J7.1 64.77,68.58 | 64.77,68.58 81.56,68.58 81.56,52.07 | R2.2 81.56,52.07 | R3.2 88.9,15.51 88.9,52.07 81.56,52.07 | 81.56,52.07 ON/OFF.3
INPUT1_NEG
  Top 0.406: X1.1 63.5,6.35 73.03,6.35 AMP1.3 73.03,19.68 72.39,20.32 70.48,20.32 69.48,21.32 1R8.1
INPUT2_NEG
  Top 0.406: 8R31.1 56.88,39.64 55.88,40.64 53.98,40.64 53.34,41.27 AMP2.3 53.34,57.15 62.87,57.15 X2.1
INPUT3_NEG
  Top 0.406: X3.1 48.26,6.35 57.78,6.35 AMP3.3 57.78,19.68 57.15,20.32 55.24,20.32 54.24,21.32 3R8.1
INPUT4_NEG
  Top 0.406: 8R23.1 41.64,39.64 40.64,40.64 38.73,40.64 38.1,41.27 AMP4.3 38.1,57.15 47.62,57.15 X4.1
INPUT5_NEG
  Top 0.406: X5.1 33.02,6.35 42.55,6.35 AMP5.3 42.55,19.68 41.91,20.32 40.01,20.32 39.01,21.32 5R8.1
INPUT6_NEG
  Top 0.406: 8R15.1 26.4,39.64 25.4,40.64 23.5,40.64 22.86,41.27 AMP6.3 22.86,57.15 32.38,57.15 X6.1
INPUT7_NEG
  Top 0.406: X7.1 17.78,6.35 27.3,6.35 AMP7.3 27.3,19.68 26.67,20.32 24.77,20.32 23.77,21.32 7R8.1
INPUT8_NEG
  Top 0.406: 8R8.1 11.16,39.64 10.16,40.64 8.26,40.64 7.62,41.27 AMP8.3 7.62,57.15 17.14,57.15 X8.1
N$10
  Top 0.813: BBB.A 77.47,38.1 J5.5
N$11
  Top 0.813: R1.1 AUX_POWER.K
N$12
  Top 0.813: REC.A 78.74,22.86 78.74,27.94 J5.1
N$13
  Top 0.813: ON/OFF.2 86.08,35.56 J5.4
N$15
  Top 0.813: REC/STOP.1 86.08,33.02 J5.3
N$16  (1 unrouted)
  Top 0.813: J5.2 84.45,30.48 84.45,26.67 REC/STOP.3
N$18
  Top 0.813: R3.1 78.74,20.32 REC.K
N$20
  Top 0.813: R2.1 77.47,52.07 BBB.K
V+
  Top 0.813: AUX_POWER.A J7.2 45.54,60.96 F1.P$1
V+_FUSED
  Top 0.813: J6.2 39.55,60.96 F1.P$2